# EAGLE design Relay_Board_1st_Iteration (EAGLE 9.6.2)
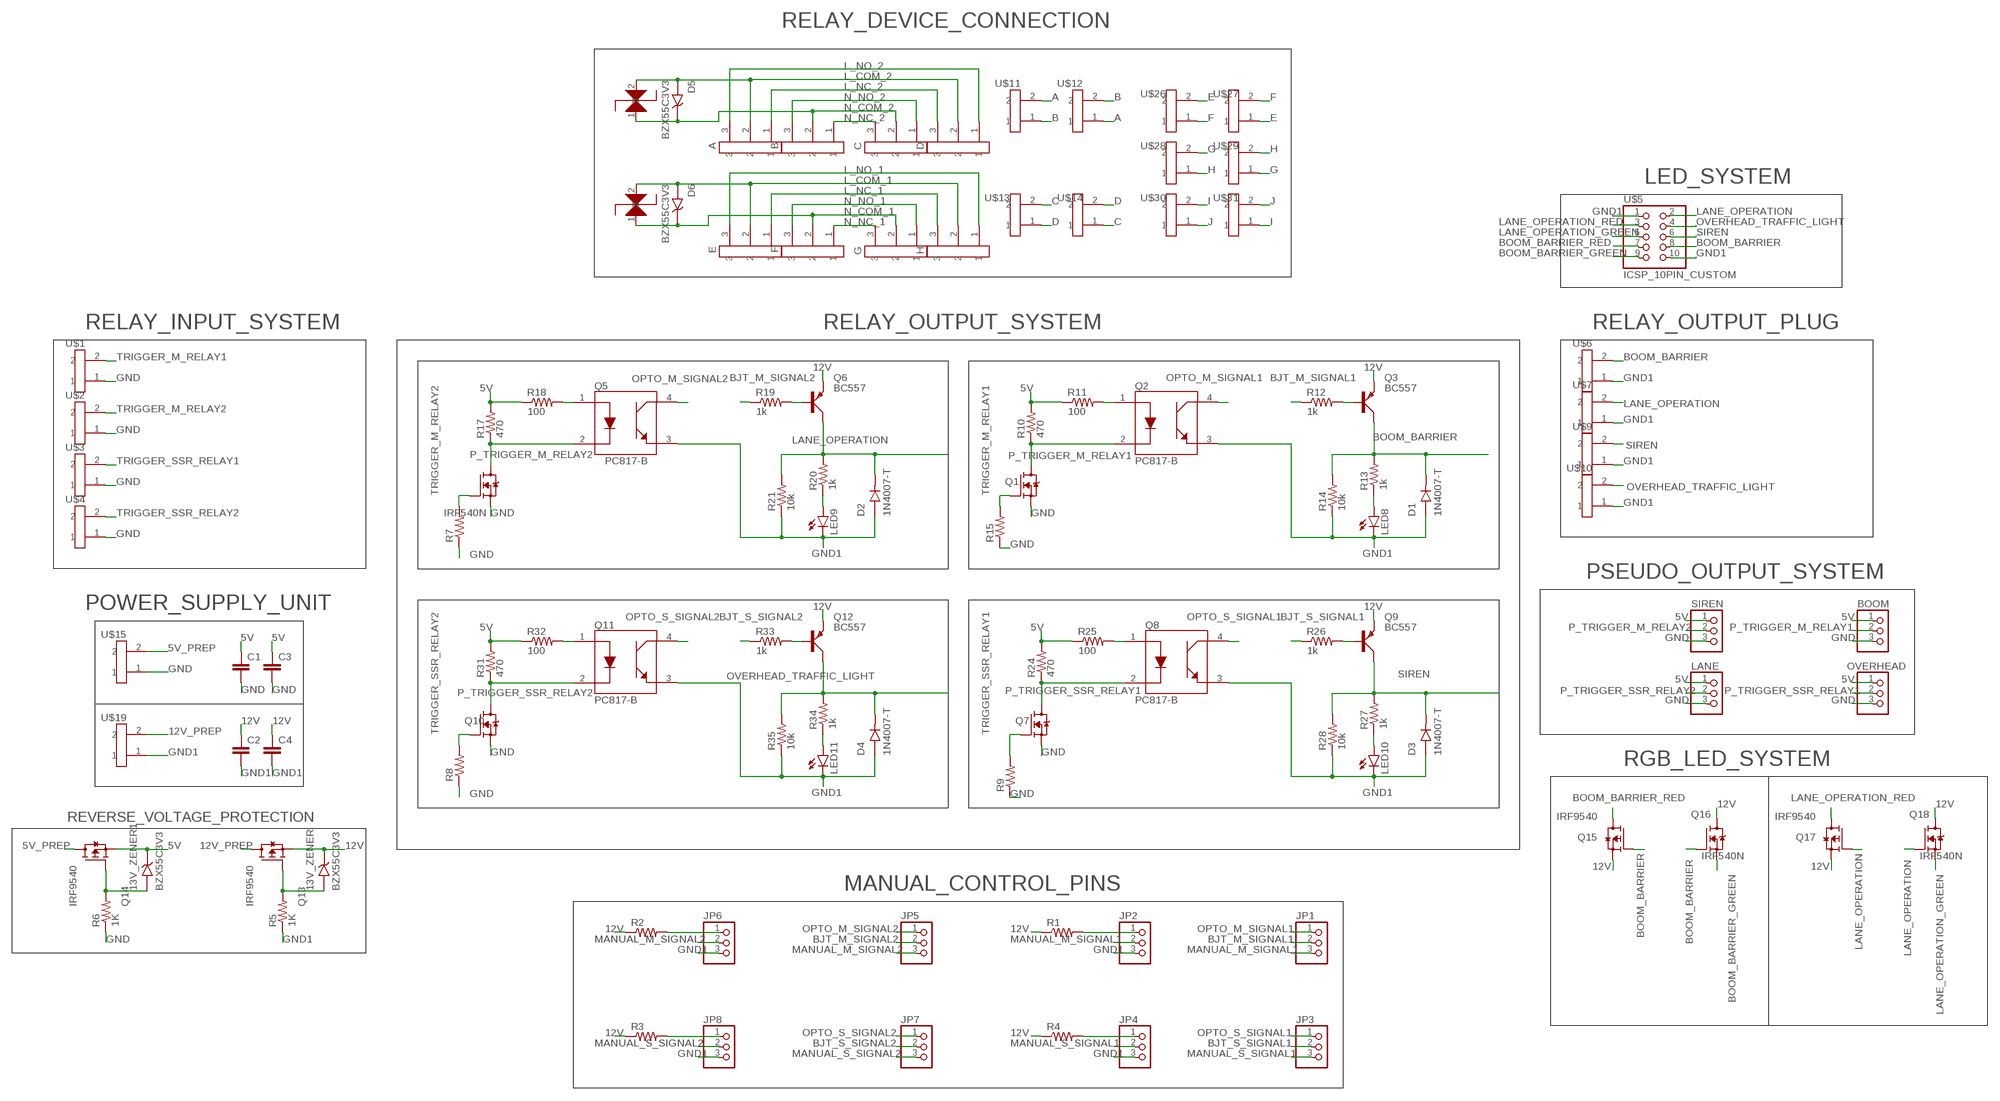
[diagram p0: schematic, sheet 1]

## Parts
13V_ZENER  BZX55C3V3  [DIOAD928W47L399D179]
13V_ZENER1  BZX55C3V3  [DIOAD928W47L399D179]
A  GREEN_PLUG_90_3  [GREEN_PLUG_90_3]
B  GREEN_PLUG_90_3  [GREEN_PLUG_90_3]
BOOM  PINHD-1X3  [1X03]
C  GREEN_PLUG_90_3  [GREEN_PLUG_90_3]
C1  CAPACITOR  [CAPACITOR]
C2  CAPACITOR  [CAPACITOR]
C3  CAPACITOR  [CAPACITOR]
C4  CAPACITOR  [CAPACITOR]
D  GREEN_PLUG_90_3  [GREEN_PLUG_90_3]
D1  1N4007-T  [DIOAD780W78L463D236]
D2  1N4007-T  [DIOAD780W78L463D236]
D3  1N4007-T  [DIOAD780W78L463D236]
D4  1N4007-T  [DIOAD780W78L463D236]
D5  BZX55C3V3  [DIOAD928W47L399D179]
D6  BZX55C3V3  [DIOAD928W47L399D179]
E  GREEN_PLUG_90_3  [GREEN_PLUG_90_3]
F  GREEN_PLUG_90_3  [GREEN_PLUG_90_3]
G  GREEN_PLUG_90_3  [GREEN_PLUG_90_3]
H  GREEN_PLUG_90_3  [GREEN_PLUG_90_3]
JP1  PINHD-1X3  [1X03]
JP2  PINHD-1X3  [1X03]
JP3  PINHD-1X3  [1X03]
JP4  PINHD-1X3  [1X03]
JP5  PINHD-1X3  [1X03]
JP6  PINHD-1X3  [1X03]
JP7  PINHD-1X3  [1X03]
JP8  PINHD-1X3  [1X03]
LANE  PINHD-1X3  [1X03]
LED8  LED  [LED]
LED9  LED  [LED]
LED10  LED  [LED]
LED11  LED  [LED]
OVERHEAD  PINHD-1X3  [1X03]
Q1  IRF540N  [TO254P1054X469X1930-3]
Q2  PC817-B  [DIP762W50P254L650H455Q4B]
Q3  BC557  [SOT54A]
Q4  IRF540N  [TO254P1054X469X1930-3]
Q5  PC817-B  [DIP762W50P254L650H455Q4B]
Q6  BC557  [SOT54A]
Q7  IRF540N  [TO254P1054X469X1930-3]
Q8  PC817-B  [DIP762W50P254L650H455Q4B]
Q9  BC557  [SOT54A]
Q10  IRF540N  [TO254P1054X469X1930-3]
Q11  PC817-B  [DIP762W50P254L650H455Q4B]
Q12  BC557  [SOT54A]
Q13  IRF9540  [TO254P1052X465X1989-3]
Q14  IRF9540  [TO254P1052X465X1989-3]
Q15  IRF9540  [TO254P1052X465X1989-3]
Q16  IRF540N  [TO254P1054X469X1930-3]
Q17  IRF9540  [TO254P1052X465X1989-3]
Q18  IRF540N  [TO254P1054X469X1930-3]
R1  RESISTOR  [RESISTOR]
R2  RESISTOR  [RESISTOR]
R3  RESISTOR  [RESISTOR]
R4  RESISTOR  [RESISTOR]
R5  1K  RESISTOR  [RESISTOR]
R6  1K  RESISTOR  [RESISTOR]
R7  RESISTOR  [RESISTOR]
R8  RESISTOR  [RESISTOR]
R9  RESISTOR  [RESISTOR]
R10  470  RESISTOR  [RESISTOR]
R11  100  RESISTOR  [RESISTOR]
R12  1k  RESISTOR  [RESISTOR]
R13  1k  RESISTOR  [RESISTOR]
R14  10k  RESISTOR  [RESISTOR]
R15  RESISTOR  [RESISTOR]
R17  470  RESISTOR  [RESISTOR]
R18  100  RESISTOR  [RESISTOR]
R19  1k  RESISTOR  [RESISTOR]
R20  1k  RESISTOR  [RESISTOR]
R21  10k  RESISTOR  [RESISTOR]
R24  470  RESISTOR  [RESISTOR]
R25  100  RESISTOR  [RESISTOR]
R26  1k  RESISTOR  [RESISTOR]
R27  1k  RESISTOR  [RESISTOR]
R28  10k  RESISTOR  [RESISTOR]
R31  470  RESISTOR  [RESISTOR]
R32  100  RESISTOR  [RESISTOR]
R33  1k  RESISTOR  [RESISTOR]
R34  1k  RESISTOR  [RESISTOR]
R35  10k  RESISTOR  [RESISTOR]
SIREN  PINHD-1X3  [1X03]
U$1  GREEN_PLUG_90_2  [GREEN_PLUG_90_2]
U$2  GREEN_PLUG_90_2  [GREEN_PLUG_90_2]
U$3  GREEN_PLUG_90_2  [GREEN_PLUG_90_2]
U$4  GREEN_PLUG_90_2  [GREEN_PLUG_90_2]
U$5  ICSP_10PIN_CUSTOM  [ICSP_10PIN_CUSTOM]
U$6  GREEN_PLUG_90_2  [GREEN_PLUG_90_2]
U$7  GREEN_PLUG_90_2  [GREEN_PLUG_90_2]
U$9  GREEN_PLUG_90_2  [GREEN_PLUG_90_2]
U$10  GREEN_PLUG_90_2  [GREEN_PLUG_90_2]
U$11  GREEN_PLUG_90_2  [GREEN_PLUG_90_2]
U$12  GREEN_PLUG_90_2  [GREEN_PLUG_90_2]
U$13  GREEN_PLUG_90_2  [GREEN_PLUG_90_2]
U$14  GREEN_PLUG_90_2  [GREEN_PLUG_90_2]
U$15  GREEN_PLUG_90_2  [GREEN_PLUG_90_2]
U$19  GREEN_PLUG_90_2  [GREEN_PLUG_90_2]
U$24  1KE100A_CUSTOM  [1KE100A_CUSTOM]
U$25  1KE100A_CUSTOM  [1KE100A_CUSTOM]
U$26  GREEN_PLUG_90_2  [GREEN_PLUG_90_2]
U$27  GREEN_PLUG_90_2  [GREEN_PLUG_90_2]
U$28  GREEN_PLUG_90_2  [GREEN_PLUG_90_2]
U$29  GREEN_PLUG_90_2  [GREEN_PLUG_90_2]
U$30  GREEN_PLUG_90_2  [GREEN_PLUG_90_2]
U$31  GREEN_PLUG_90_2  [GREEN_PLUG_90_2]

## Nets
5V: 13V_ZENER1.C(K) BOOM.1 C1.1 C3.1 LANE.1 OVERHEAD.1 Q14.3(S) R10.2 R11.1 R17.2 R18.1 R24.2 R25.1 R31.2 R32.1 SIREN.1
5V_PREP: Q14.2(D) U$15.2
12V: 13V_ZENER.C(K) C2.1 C4.1 Q3.E Q6.E Q9.E Q12.E Q13.3(S) Q15.3(S) Q16.2(D) Q17.3(S) Q18.2(D) R1.1 R2.1 R3.1 R4.1
12V_PREP: Q13.2(D) U$19.2
A: U$11.2 U$12.1
B: U$11.1 U$12.2
BJT_M_SIGNAL1: JP1.2 R12.1
BJT_M_SIGNAL2: JP5.2 R19.1
BJT_S_SIGNAL1: JP3.2 R26.1
BJT_S_SIGNAL2: JP7.2 R33.1
BOOM_BARRIER: D1.K Q3.C Q15.1(G) Q16.1(G) R13.2 R14.2 U$5.8 U$6.2
BOOM_BARRIER_GREEN: Q16.3(S) U$5.9
BOOM_BARRIER_RED: Q15.2(D) U$5.7
C: U$13.2 U$14.1
D: U$13.1 U$14.2
E: U$26.2 U$27.1
F: U$26.1 U$27.2
G: U$28.2 U$29.1
GND: BOOM.3 C1.2 C3.2 LANE.3 OVERHEAD.3 Q1.3(S) Q4.3(S) Q7.3(S) Q10.3(S) R6.1 R7.1 R8.1 R9.1 R15.1 SIREN.3 U$1.1 U$2.1 U$3.1 U$4.1 U$15.1
GND1: C2.2 C4.2 D1.A D2.A D3.A D4.A JP2.3 JP4.3 JP6.3 JP8.3 LED8.K(C) LED9.K(C) LED10.K(C) LED11.K(C) Q2.3(EMITTER) Q5.3(EMITTER) Q8.3(EMITTER) Q11.3(EMITTER) R5.1 R14.1 R21.1 R28.1 R35.1 U$5.1 U$5.10 U$6.1 U$7.1 U$9.1 U$10.1 U$19.1
H: U$28.1 U$29.2
I: U$30.2 U$31.1
J: U$30.1 U$31.2
L_COM_1: D6.A E.2 H.2 U$25.2
L_COM_2: A.2 D5.A D.2 U$24.2
L_NC_1: E.1 H.3
L_NC_2: A.1 D.3
L_NO_1: E.3 H.1
L_NO_2: A.3 D.1
LANE_OPERATION: D2.K Q6.C Q17.1(G) Q18.1(G) R20.2 R21.2 U$5.2 U$7.2
LANE_OPERATION_GREEN: Q18.3(S) U$5.5
LANE_OPERATION_RED: Q17.2(D) U$5.3
MANUAL_M_SIGNAL1: JP1.3 JP2.2
MANUAL_M_SIGNAL2: JP5.3 JP6.2
MANUAL_S_SIGNAL1: JP3.3 JP4.2
MANUAL_S_SIGNAL2: JP7.3 JP8.2
N$1: 13V_ZENER1.A Q14.1(G) R6.2
N$2: Q3.B R12.2
N$3: 13V_ZENER.A Q13.1(G) R5.2
N$8: JP2.1 R1.2
N$11: JP4.1 R4.2
N$12: LED8.A R13.1
N$14: Q2.1(ANODE) R11.2
N$16: Q6.B R19.2
N$18: LED9.A R20.1
N$19: Q5.1(ANODE) R18.2
N$23: Q9.B R26.2
N$25: LED10.A R27.1
N$26: Q8.1(ANODE) R25.2
N$28: JP6.1 R2.2
N$30: Q12.B R33.2
N$32: LED11.A R34.1
N$33: Q11.1(ANODE) R32.2
N$34: JP8.1 R3.2
N_COM_1: D6.C(K) F.2 G.2 U$25.1
N_COM_2: B.2 C.2 D5.C(K) U$24.1
N_NC_1: F.1 G.3
N_NC_2: B.1 C.3
N_NO_1: F.3 G.1
N_NO_2: B.3 C.1
OPTO_M_SIGNAL1: JP1.1 Q2.4(COLLECTOR)
OPTO_M_SIGNAL2: JP5.1 Q5.4(COLLECTOR)
OPTO_S_SIGNAL1: JP3.1 Q8.4(COLLECTOR)
OPTO_S_SIGNAL2: JP7.1 Q11.4(COLLECTOR)
OVERHEAD_TRAFFIC_LIGHT: D4.K Q12.C R34.2 R35.2 U$5.4 U$10.2
P_TRIGGER_M_RELAY1: BOOM.2 Q1.2(D) Q2.2(CATHODE) R10.1
P_TRIGGER_M_RELAY2: Q4.2(D) Q5.2(CATHODE) R17.1 SIREN.2
P_TRIGGER_SSR_RELAY1: OVERHEAD.2 Q7.2(D) Q8.2(CATHODE) R24.1
P_TRIGGER_SSR_RELAY2: LANE.2 Q10.2(D) Q11.2(CATHODE) R31.1
SIREN: D3.K Q9.C R27.2 R28.2 U$5.6 U$9.2
TRIGGER_M_RELAY1: Q1.1(G) R15.2 U$1.2
TRIGGER_M_RELAY2: Q4.1(G) R7.2 U$2.2
TRIGGER_SSR_RELAY1: Q7.1(G) R9.2 U$3.2
TRIGGER_SSR_RELAY2: Q10.1(G) R8.2 U$4.2

## Notes on the sheet
- RELAY_DEVICE_CONNECTION
- LED_SYSTEM
- RELAY_INPUT_SYSTEM | RELAY_OUTPUT_SYSTEM | RELAY_OUTPUT_PLUG
- PSEUDO_OUTPUT_SYSTEM
- POWER_SUPPLY_UNIT
- RGB_LED_SYSTEM
- REVERSE_VOLTAGE_PROTECTION
- MANUAL_CONTROL_PINS

## Library data of the parts
13V_ZENER 13V_ZENER1 D5 D6 = BZX55C3V3:BZX55C3V3: Check availability <https://pricing.snapeda.com/parts/BZX55C3V3-TR/Vishay%20Semiconductor/view-part?ref=eda>; AVAILABILITY: In Stock; CHECK_PRICES: https://www.snapeda.com/parts/BZX55C3V3-TR/Vishay/view-part/?ref=eda; DESCRIPTION: Zener Diode 3.3 V 500 mW ±6% Through Hole DO-204AH (DO-35); MF: Vishay Semiconductor; MP: BZX55C3V3-TR; PACKAGE: DO-35 NXP Semiconductors; PRICE: None; SNAPEDA_LINK: https://www.snapeda.com/parts/BZX55C3V3-TR/Vishay/view-part/?ref=snap
A B C D E F G H = Green_plug_90:GREEN_PLUG_90_3
BOOM JP1-JP8 LANE OVERHEAD SIREN = pinhead:PINHD-1X3: PIN HEADER
C1-C4 = Hand_Solder:CAPACITOR: Hand Solder Capacitor
D1-D4 = 1N4007-T:1N4007-T: Check availability <https://pricing.snapeda.com/parts/1N4007-T/Diodes%20Incorporated/view-part?ref=eda>; AVAILABILITY: In Stock; CHECK_PRICES: https://www.snapeda.com/parts/1N4007-T/Diodes+Inc./view-part/?ref=eda; DESCRIPTION: Diode Standard 1A 1000V 1Vf DO41 | Diodes Inc 1N4007-T; MF: Diodes Incorporated; MP: 1N4007-T; PACKAGE: DO-41 Diodes Inc.; PRICE: None; SNAPEDA_LINK: https://www.snapeda.com/parts/1N4007-T/Diodes+Inc./view-part/?ref=snap
LED8-LED11 = Hand_Solder:LED: LED HAND SOLDER
Q1 Q4 Q7 Q10 Q16 Q18 = IRF540N:IRF540N: Check availability <https://pricing.snapeda.com/parts/IRF540N/Infineon%20Technologies/view-part?ref=eda>; AVAILABILITY: In Stock; CHECK_PRICES: https://www.snapeda.com/parts/IRF540N/Infineon/view-part/?ref=eda; DESCRIPTION: Transistor NPN MOS IRF540/IRF540N INTERNATIONAL RECTIFIER Ampere=28 V=100 TO220; MF: Infineon Technologies; MP: IRF540N; PACKAGE: Package; PRICE: None; SNAPEDA_LINK: https://www.snapeda.com/parts/IRF540N/Infineon/view-part/?ref=snap
Q2 Q5 Q8 Q11 = PC817-B:PC817-B: Check availability <https://pricing.snapeda.com/parts/PC817-B/American%20Bright/view-part?ref=eda>; AVAILABILITY: Not in stock; CHECK_PRICES: https://www.snapeda.com/parts/PC817-B/American+Bright/view-part/?ref=eda; DESCRIPTION: Phototransistors 4-DIP (0.300, 7.62mm); MF: American Bright; MP: PC817-B; PACKAGE: DIP-4 American Bright; PRICE: None; SNAPEDA_LINK: https://www.snapeda.com/parts/PC817-B/American+Bright/view-part/?ref=snap
Q3 Q6 Q9 Q12 = BC557:BC557: Check availability <https://pricing.snapeda.com/parts/BC557/ON%20Semiconductor/view-part?ref=eda>; AVAILABILITY: Not in stock; CHECK_PRICES: https://www.snapeda.com/parts/BC557/Onsemi/view-part/?ref=eda; DESCRIPTION: Bipolar (BJT) Transistor PNP 45 V 100 mA 320MHz 625 mW Through Hole TO-92 (TO-226); MF: ON Semiconductor; MP: BC557; PACKAGE: E-PKG AXIAL-LEADED-2 ON Semiconductor; PRICE: None; SNAPEDA_LINK: https://www.snapeda.com/parts/BC557/Onsemi/view-part/?ref=snap
Q13-Q15 Q17 = IRF9540:IRF9540: Trans MOSFET P-CH 100V 6.8A 3-Pin(3+Tab) TO-220AB Check availability <https://pricing.snapeda.com/parts/IRF9540/Vishay%20Siliconix/view-part?ref=eda>; AVAILABILITY: In Stock; CHECK_PRICES: https://www.snapeda.com/parts/IRF9540/Vishay/view-part/?ref=eda; DESCRIPTION: P-Channel 100 V 19A (Tc) 3.7W (Ta), 150W (Tc) Surface Mount D²PAK (TO-263); MF: Vishay Siliconix; MP: IRF9540; PACKAGE: TO-220-3 Vishay; PRICE: None; SNAPEDA_LINK: https://www.snapeda.com/parts/IRF9540/Vishay/view-part/?ref=snap
R1-R15 R17-R21 R24-R28 R31-R35 = Hand_Solder:RESISTOR: Hand Solder Resistor
U$1-U$4 U$6 U$7 U$9-U$15 U$19 U$26-U$31 = Green_plug_90:GREEN_PLUG_90_2
U$5 = ISCP_10PIN_CUSTOM:ICSP_10PIN_CUSTOM
U$24 U$25 = 1KE100A_CUSTOM:1KE100A_CUSTOM

## Board
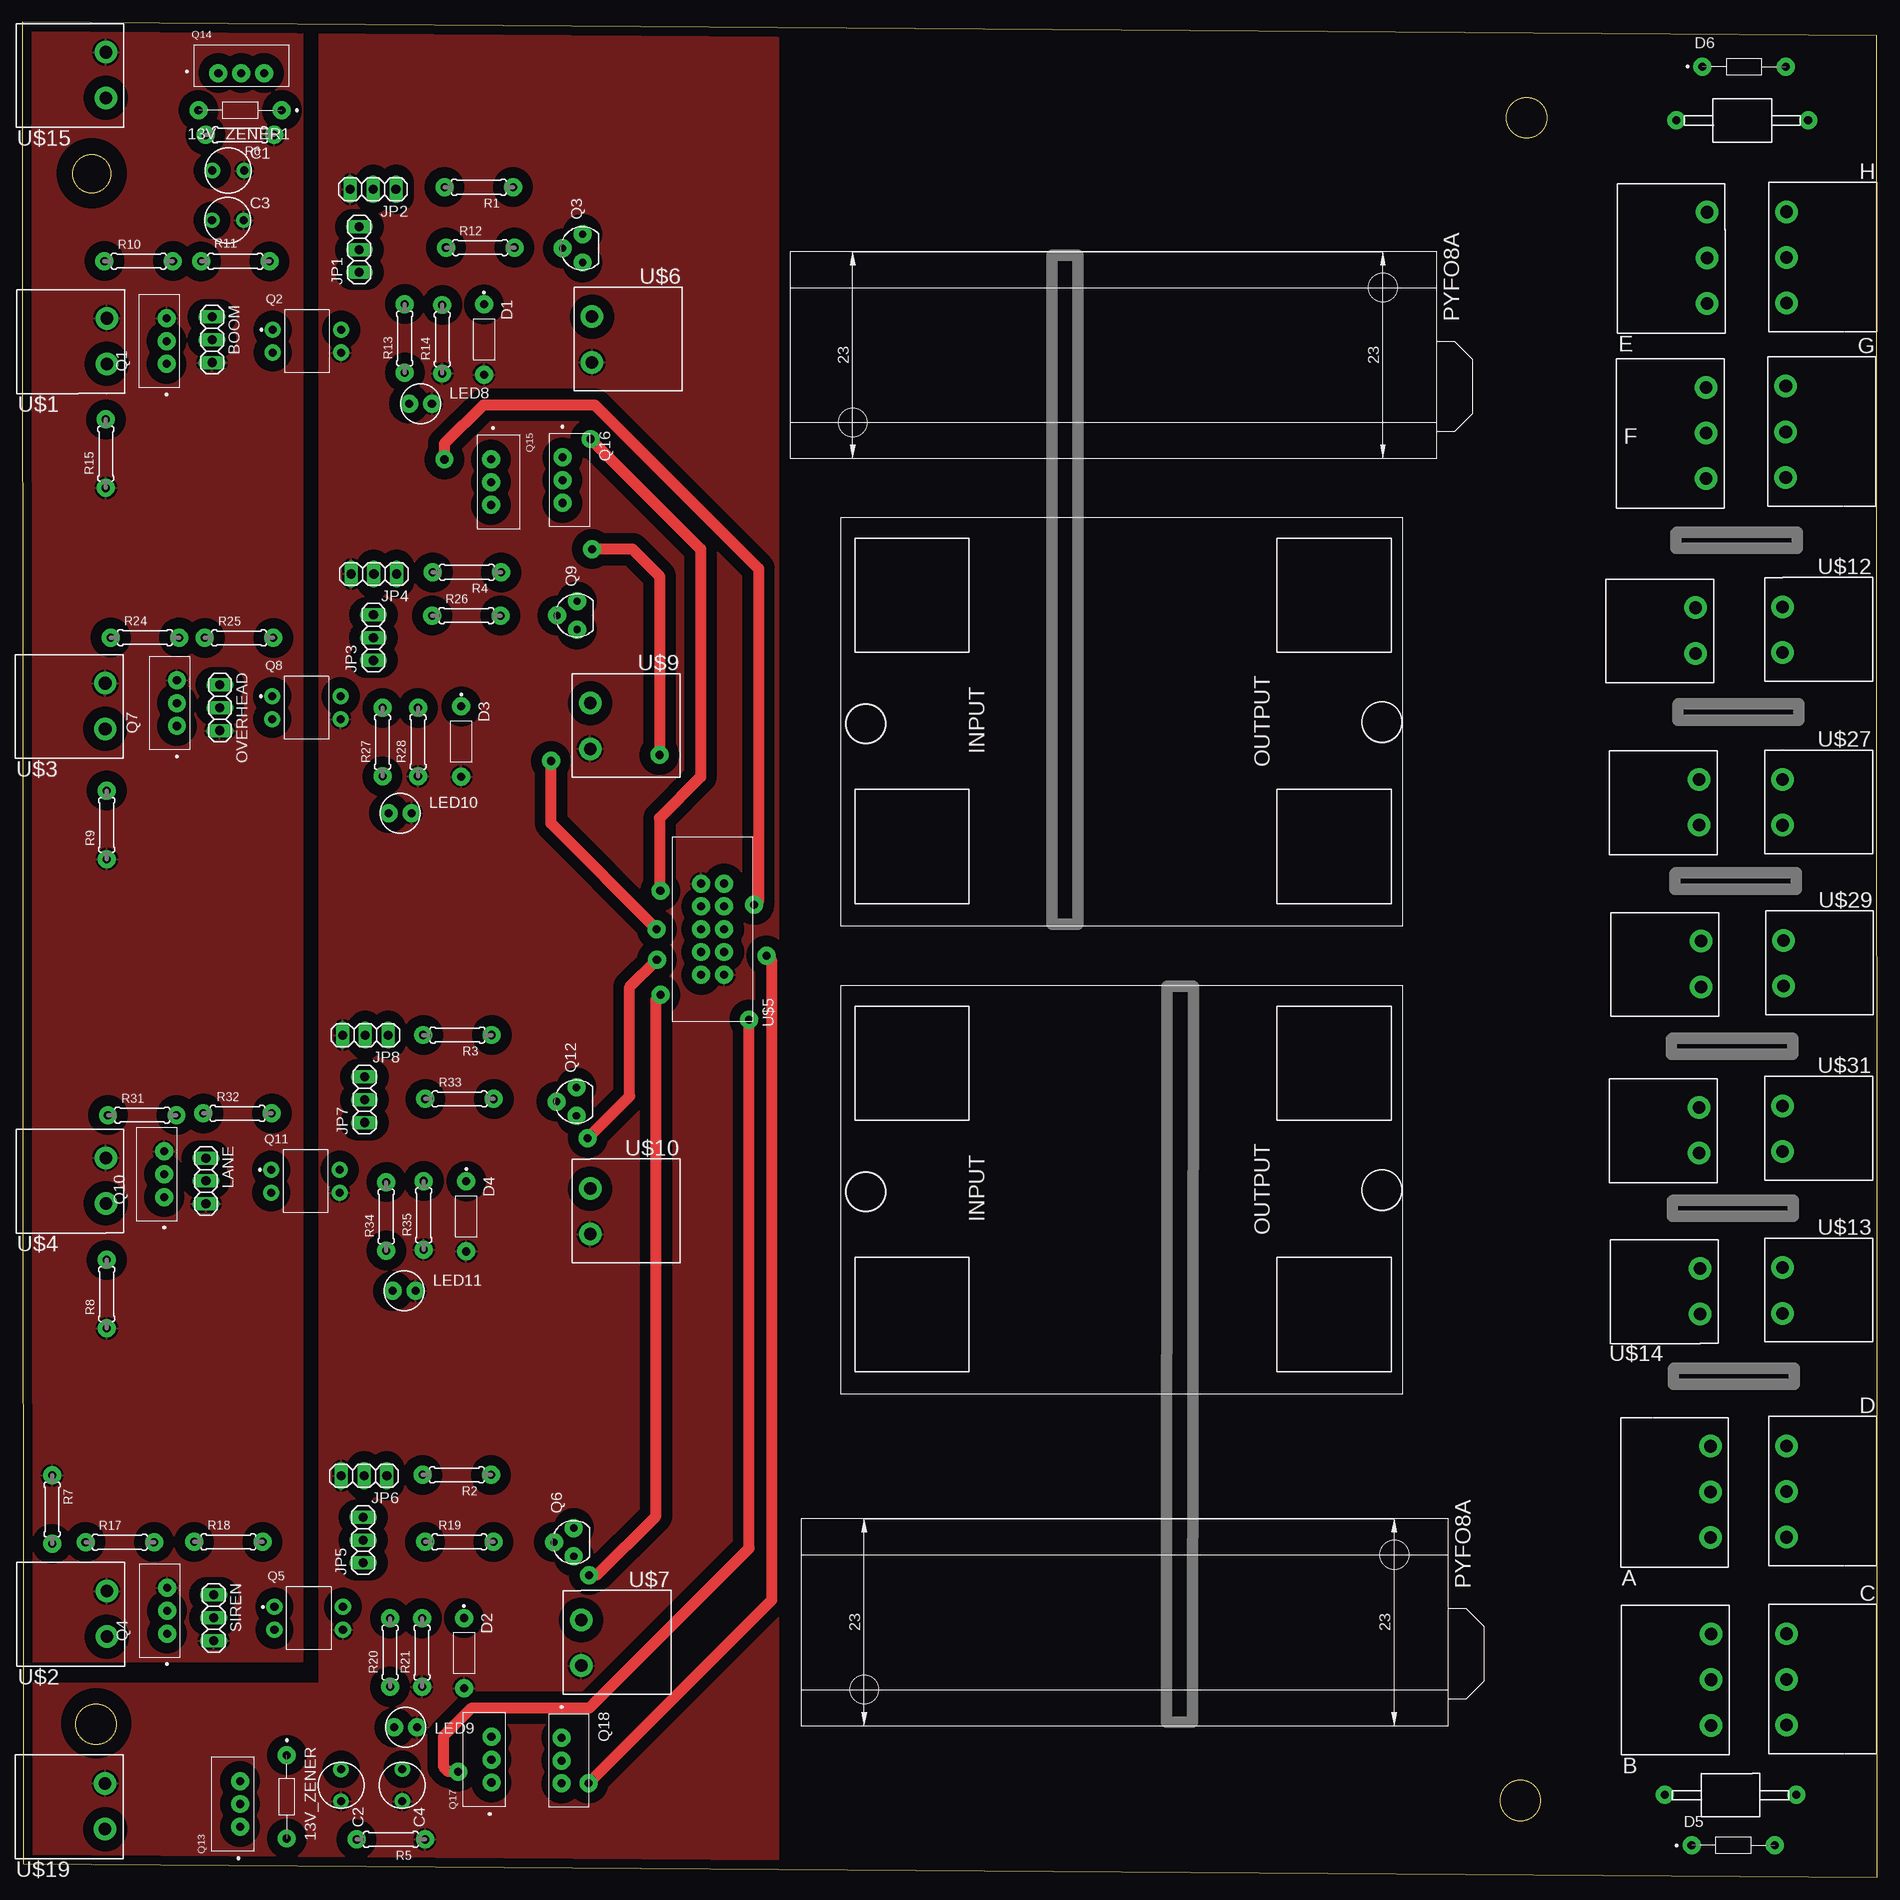
[diagram p1: board, top side]
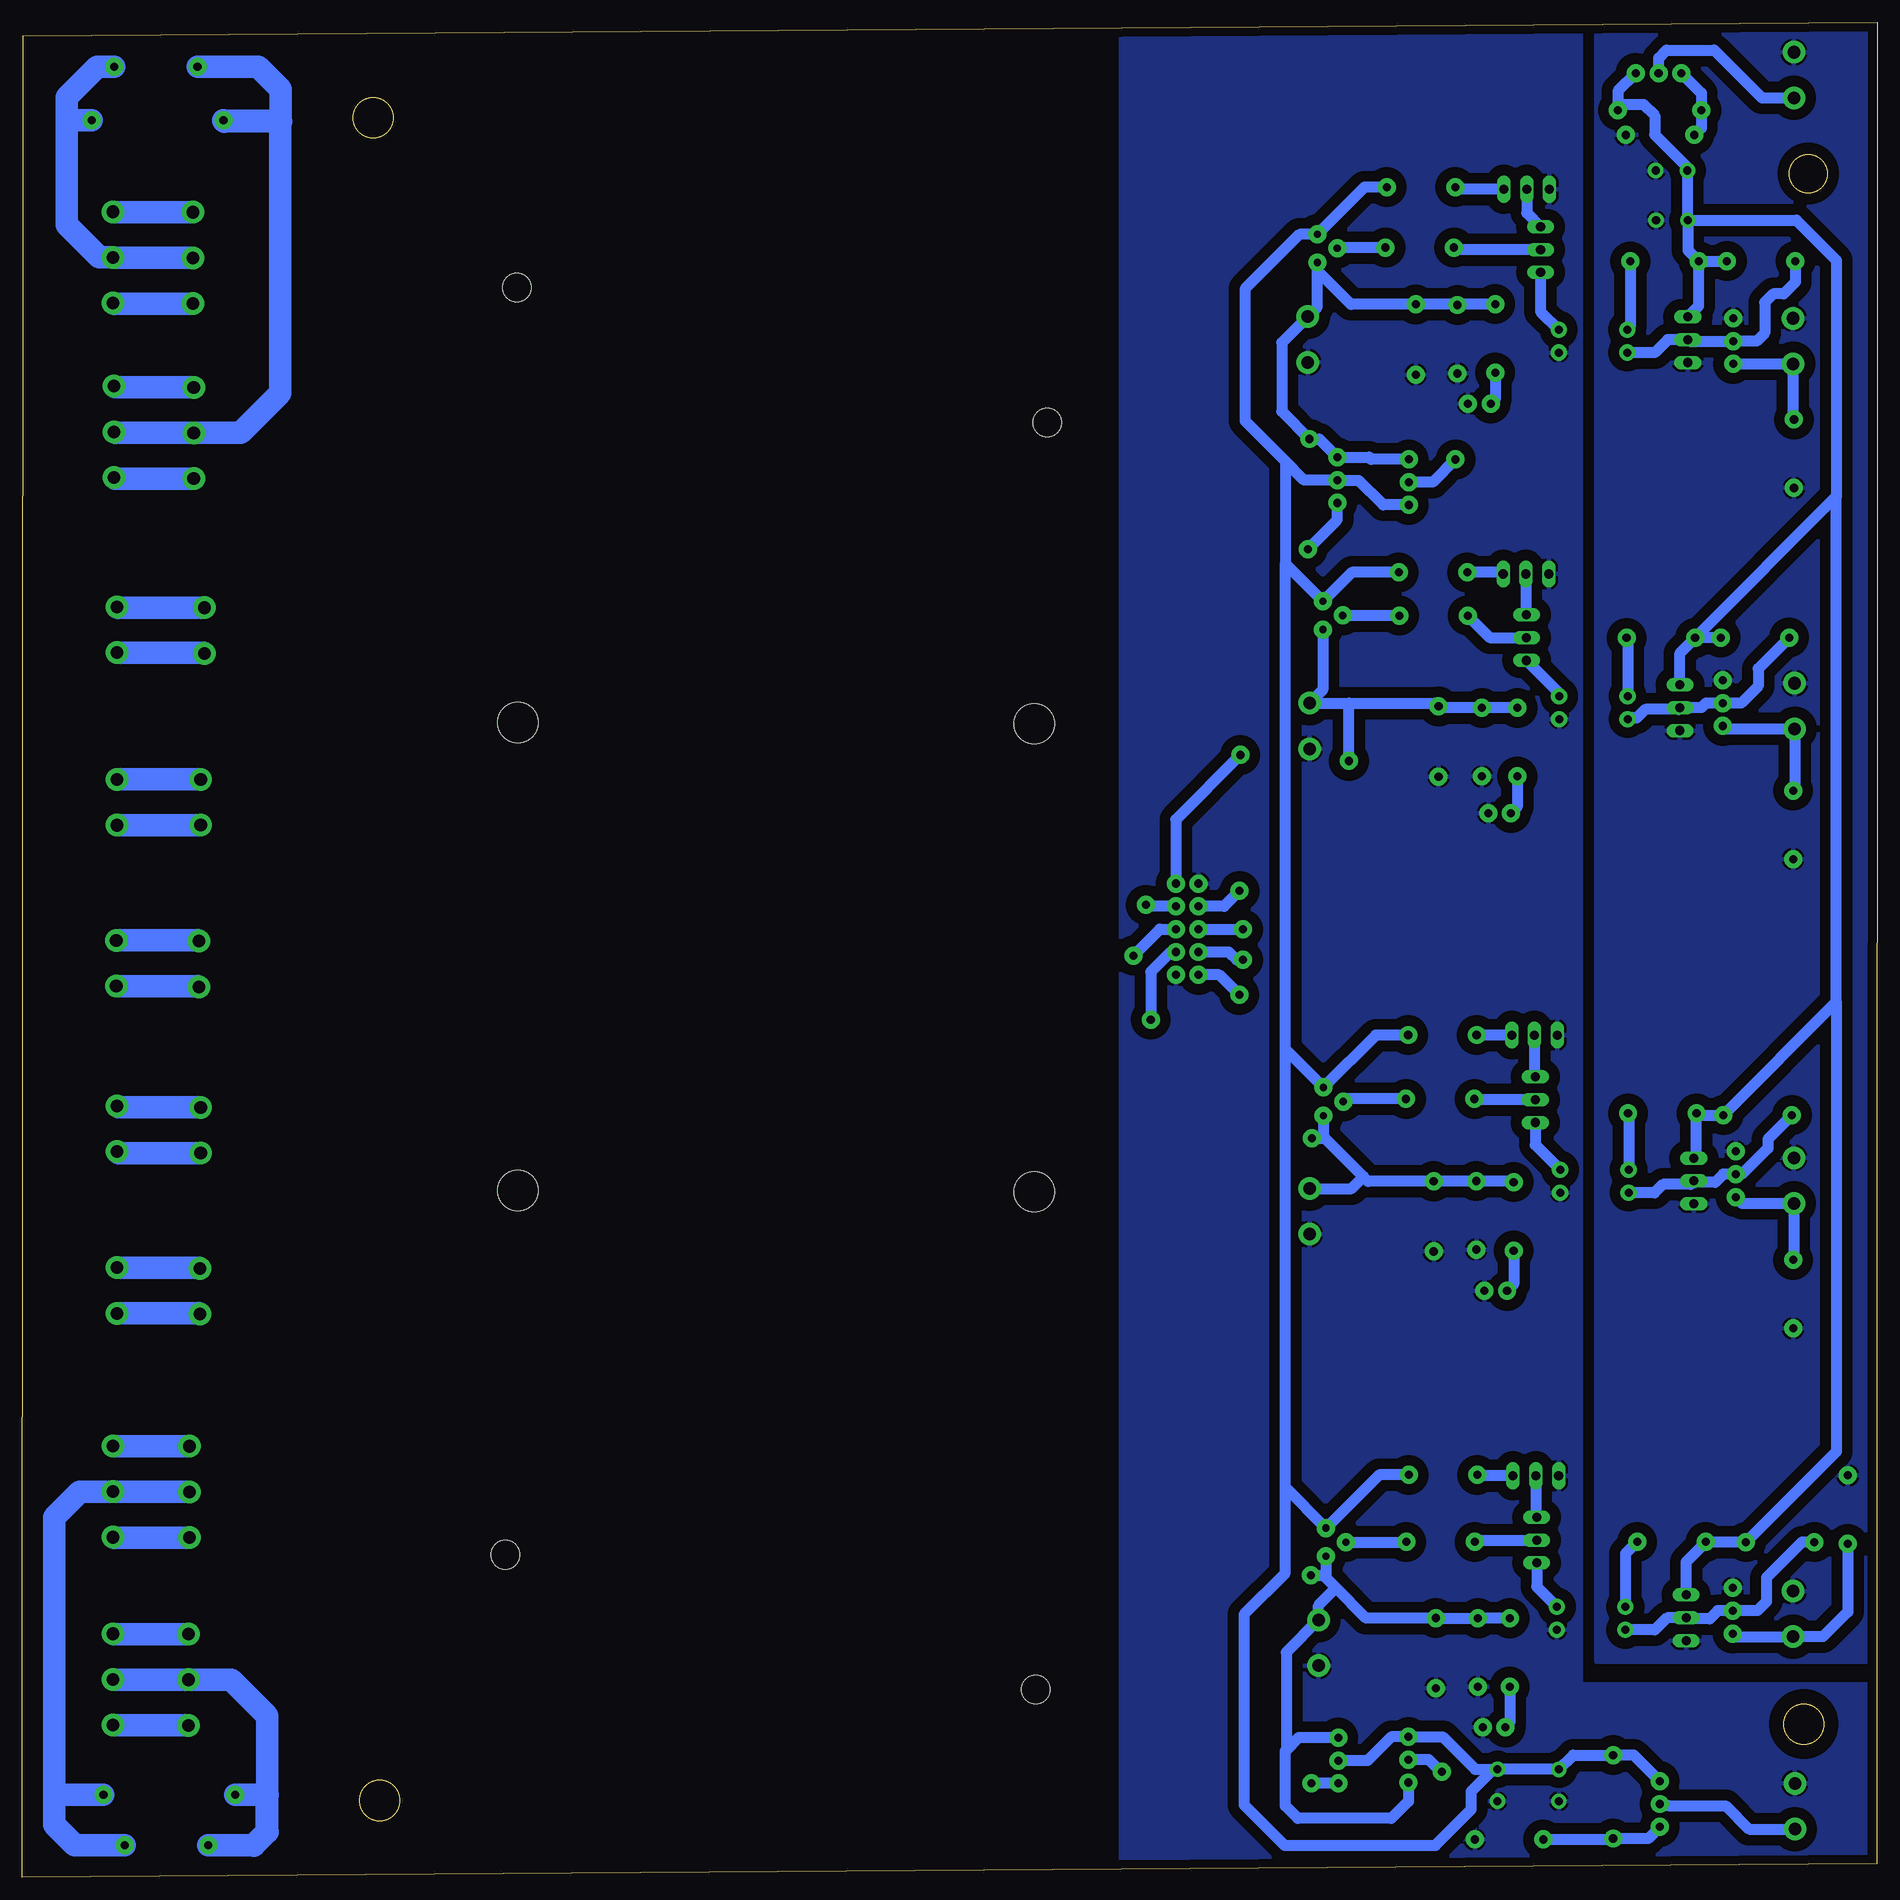
[diagram p2: board, bottom side, seen from below]

Size 206.42 x 206.35 mm. Coordinates in mm from the lower left corner, seen from the top.
Outline: 0.09,1.47 206.42,0 206.33,204.88 0,206.35 0.09,1.47
Outline: circle at 7.69,189.54 radius 2.12
Outline: circle at 8.19,17.04 radius 2.24
Outline: circle at 166.69,8.54 radius 2.24
Outline: circle at 167.39,195.74 radius 2.24
Copper layers (1*16): Top 0.035mm / dielectric 1.5mm / Bottom 0.035mm
Design rules "default *": minimum track width 1.2mm, minimum drill 0.35mm, track to track 1.2mm, track to pad 0.5mm, pad to pad 0.5mm, via to via 0.8mm, smd to smd 6mil, copper to edge 40mil, drill to drill 6mil, minimum pad ring 10mil, minimum via ring 8mil, stop-mask expansion 4mil, vias tented up to drill 0mil, thermal gap 10mil
tRestrict: area 162.9,4.7 to 170.5,12.3; area 4.4,13.3 to 12,20.9; area 3.9,185.8 to 11.5,193.4; area 163.6,191.8 to 171.2,199.5
bRestrict: area 4.4,13.2 to 12,20.8; area 4.3,186.2 to 11,192.9; area 162.9,4.7 to 170.5,12.3; area 163.6,191.9 to 171.2,199.5

### Footprints (pad centres in the part's own frame; a part is rotated, then mirrored left to right if it is on the bottom)
DIOAD928W47L399D179 = drill 0.9 pad 2: A 4.64,0; C -4.64,0
GREEN_PLUG_90_3 = drill 1.4 pad 2.5: 1 -0.041,5.012; 2 -0.041,-0.068; 3 -0.041,-5.148
1X03 = drill 1.016 long: 1 -2.54,0; 2 0,0; 3 2.54,0
CAPACITOR = drill 0.9 pad 1.7: 1 -1.77,0; 2 1.77,0
DIOAD780W78L463D236 = drill 0.9 pad 2: A 3.905,0; K -3.905,0
LED = drill 0.9 pad 2: A -1.292,-0.049; K 1.248,-0.049
TO254P1054X469X1930-3 = drill 0.9 pad 2: 1 -2.54,-0.81; 2 0,-0.81; 3 2.54,-0.81
DIP762W50P254L650H455Q4B = drill 0.9 pad 1.8: 1 -3.81,1.27; 2 -3.81,-1.27; 3 3.81,-1.27; 4 3.81,1.27
SOT54A = drill 0.8 pad 2: B 0,2.205; C -1.57,0; E 1.57,0
TO254P1052X465X1989-3 = drill 0.9 pad 2: 1 0,0; 2 2.54,0; 3 5.08,0
RESISTOR = drill 0.9 pad 2: 1 -3.777,0.007; 2 3.843,0.007
GREEN_PLUG_90_2 = drill 1.4 pad 2.5: 1 0,0; 2 0,-5.08
ICSP_10PIN_CUSTOM = drill 0.9 pad 2: 1 -5.08,-1.27; 2 -5.08,1.27; 3 -2.54,-1.27; 4 -2.54,1.27; 5 0,-1.27; 6 0,1.27; 7 2.54,-1.27; 8 2.54,1.27; 9 5.08,-1.27; 10 5.08,1.27
PYF08A-E = hole 3.2: 4,65; 19,6
SSR-40DASOLIDSTATERELAYMODULE = hole 4.5: 59.75,-22.55; 2.3,-22.7
1KE100A_CUSTOM = drill 0.9 pad 2: 1 0.027,7.334; 2 0.027,-7.321

### Placement (x,y rotation side)
13V_ZENER  29.41,8.95 270 top
13V_ZENER1  24.23,196.58 180 top
A  187.89,42.94 0 top
B  187.97,22.04 0 top
BOOM  21.1,171.05 270 top
C  196.29,21.94 180 top
C1  22.9,189.88 0 top
C2  35.45,10.22 270 top
C3  22.85,184.35 0 top
C4  42.27,10.23 270 top
D  196.29,42.84 180 top
D1  51.36,171.07 270 top
D2  49.14,24.93 270 top
D3  48.83,126.35 270 top
D4  49.38,73.52 270 top
D5  190.39,3.54 0 top
D6  191.59,201.44 0 top
E  187.51,180.22 0 top
F  187.4,160.75 0 top
G  196.19,160.74 180 top
H  196.29,180.14 180 top
JP1  37.48,181.08 90 top
JP2  39.02,187.79 180 top
JP3  39.05,137.91 90 top
JP4  39.11,144.99 180 top
JP5  37.91,37.51 90 top
JP6  38.01,44.65 180 top
JP7  38.07,86.5 90 top
JP8  38.15,93.68 180 top
LANE  20.42,77.46 270 top
LED8  44.32,163.98 0 top
LED9  42.67,16.71 0 top
LED10  42.06,118.44 0 top
LED11  42.5,65.28 0 top
OVERHEAD  21.97,130.11 270 top
Q1  15.23,170.9 90 top
Q2  31.65,170.89 0 top
Q3  62.32,181.21 90 top
Q4  15.28,29.65 90 top
Q5  31.85,28.81 0 top
Q6  61.35,37.27 90 top
Q7  16.38,130.62 90 top
Q8  31.6,130.11 0 top
Q9  61.71,140.37 90 top
Q10  14.96,78.21 90 top
Q11  31.49,77.43 0 top
Q12  61.65,86.29 90 top
Q13  24.21,5.6 90 top
Q14  21.81,200.71 0 top
Q15  52.15,157.74 270 top
Q16  60.91,155.43 270 top
Q17  52.19,10.54 90 top
Q18  60.8,12.98 270 top
R1  50.81,188.03 180 top
R2  48.37,44.77 180 top
R3  48.44,93.7 180 top
R4  49.49,145.18 180 top
R5  41.02,4.21 180 top
R6  24.23,193.84 180 top
R7  3.29,40.94 270 top
R8  9.39,64.84 90 top
R9  9.39,117.04 90 top
R10  12.9,179.79 0 top
R11  23.65,179.77 0 top
R12  50.9,181.3 0 top
R13  42.54,171.16 90 top
R14  46.73,171.07 90 top
R15  9.29,158.34 90 top
R17  10.79,37.27 0 top
R18  22.88,37.3 0 top
R19  48.58,37.29 0 top
R20  40.91,24.97 90 top
R21  44.46,24.97 90 top
R24  13.6,137.91 0 top
R25  24.06,137.87 0 top
R26  49.36,140.36 0 top
R27  40.07,126.26 90 top
R28  44.01,126.26 90 top
R31  13.29,84.78 0 top
R32  23.9,84.97 0 top
R33  48.61,86.57 0 top
R34  40.49,73.48 90 top
R35  44.65,73.61 90 top
SIREN  21.28,28.86 270 top
U$1  9.39,173.44 0 top
U$2  9.39,31.84 0 top
U$3  9.21,132.84 0 top
U$4  9.29,80.04 0 top
U$5  76.81,105.47 90 top
U$6  63.39,168.54 180 top
U$7  62.19,23.54 180 top
U$8  [PYF08A-E]  157.4,157.85 90 top
U$9  63.19,125.54 180 top
U$10  63.19,71.54 180 top
U$11  186.19,141.24 0 top
U$12  195.89,136.24 180 top
U$13  195.89,62.74 180 top
U$14  186.69,67.74 0 top
U$15  9.29,203.04 0 top
U$16  [PYF08A-E]  158.67,16.88 90 top
U$17  [SSR-40DASOLIDSTATERELAYMODULE]  153.59,105.78 180 top
U$18  [SSR-40DASOLIDSTATERELAYMODULE]  153.59,53.71 180 top
U$19  9.19,10.44 0 top
U$24  190.09,9.14 90 top
U$25  191.39,195.44 90 top
U$26  186.59,122.14 0 top
U$27  195.89,117.04 180 top
U$28  186.79,104.14 0 top
U$29  195.99,99.14 180 top
U$30  186.59,85.64 0 top
U$31  195.89,80.74 180 top

### Tracks (layer width: path | path; a pad name or v marks a point on that pad's centre or on a via)
5V
  Bottom 1.2: 19.08,37.27 R17.2 4.55,47.36 4.55,97.37 | 19.08,37.27 R18.1 | SIREN.1 21.28,35.07 19.08,37.27 | 4.55,153.61 4.55,179.89 9.01,184.35 C3.1 | 4.55,97.37 R31.2 19.93,84.79 R32.1 20.12,80.3 LANE.1 | Q14.3 28.87,198.73 13V_ZENER1.C 28.2,197.25 26.03,197.25 24.78,196 24.78,193.87 21.13,190.22 C1.1 21.13,184.39 C3.1 | R24.2 20.25,137.91 R25.1 | OVERHEAD.1 21.97,136.19 R25.1 | 4.55,97.37 4.55,153.61 | R25.1 4.55,153.61 | BOOM.1 19.87,174.82 R11.1 | R11.1 19.85,179.8 R10.2 | C3.1 21.08,180.99 R11.1
5V_PREP
  Bottom 1.2: Q14.2 24.35,202.38 23.46,203.26 18.15,203.26 12.84,197.96 U$15.2
12V
  Bottom 1.2: R1.1 57.08,188.02 Q3.E 64.3,182.78 70.38,176.7 70.38,162.02 65.88,157.52 | 65.88,157.52 65.88,146.11 | 65.88,146.11 Q9.E 58.48,145.17 R4.1 | R3.1 55.81,93.7 Q12.E 65.88,92.09 | R2.1 55.43,44.76 Q6.E 65.88,43.37 | 65.88,92.09 65.88,146.11 | 65.88,43.37 65.88,92.09 | Q13.3 27.11,13.59 13V_ZENER.C 33.86,13.59 C2.1 42.26,11.99 | Q15.3 54.99,152.66 57.73,155.4 60.07,155.4 Q16.2 63.79,155.43 65.88,157.52 | 42.26,11.99 C4.1 | 65.88,43.37 65.88,33.84 70.49,29.23 70.49,8.04 65.99,3.54 49.19,3.54 45.19,7.54 45.19,9.54 42.73,11.99 | 42.73,11.99 42.26,11.99 | Q18.2 56.74,12.98 54.11,15.62 Q17.3 48.37,15.62 44.74,11.99 42.73,11.99
12V_PREP
  Bottom 1.2: Q13.2 24.07,8 23.22,8 23.15,7.94 16.89,7.94 14.31,5.36 U$19.2
A
  Bottom 2.5: U$12.1 186.27,136.24 U$11.2
B
  Bottom 2.5: U$11.1 195.81,141.24 U$12.2
BJT_M_SIGNAL1
  Bottom 1.2: JP1.2 46.9,181.08 R12.1
BJT_M_SIGNAL2
  Bottom 1.2: R19.1 44.6,37.51 JP5.2
BJT_S_SIGNAL1
  Bottom 1.2: R26.1 43.13,137.91 JP3.2
BJT_S_SIGNAL2
  Bottom 1.2: JP7.2 44.75,86.5 R33.1
BOOM_BARRIER  (via drill 0.9 pad 2)
  Top 1.2: v63.2,160 75.46,147.74 75.46,122.42 70.89,117.84 70.89,109.84 v70.99,109.74
  Bottom 1.2: R13.2 46.63,175.01 R14.2 46.78,174.98 D1.K 58.57,174.98 62.32,178.72 Q3.C 62.32,174.69 U$6.2 66.29,170.72 66.29,163.09 v63.2,160 62.1,160 60.08,157.99 | Q16.1 60.08,157.99 | 60.08,157.99 56.58,157.99 56.34,157.74 Q15.1 | v70.99,109.74 72.71,108.01 U$5.8
BOOM_BARRIER_GREEN  (via drill 0.9 pad 2)
  Top 1.2: v63.38,147.75 67.88,147.75 70.91,144.71 70.91,124.85 v70.89,124.85
  Bottom 1.2: v63.38,147.75 60.1,151.03 Q16.3 | v70.89,124.85 78.08,117.66 U$5.9
BOOM_BARRIER_RED  (via drill 0.9 pad 2)
  Top 1.2: v46.95,157.73 46.95,159.47 51.29,163.81 63.68,163.81 81.92,145.58 81.92,108.67 v81.42,108.17
  Bottom 1.2: v46.95,157.73 49.48,155.2 Q15.2 | U$5.7 81.26,108.01 v81.42,108.17
C
  Bottom 2.5: U$14.1 186.77,67.82 U$13.2
D
  Bottom 2.5: U$13.1 186.77,62.74 U$14.2
E
  Bottom 2.5: U$27.1 186.61,117.04 U$26.2
F
  Bottom 2.5: U$26.1 195.87,122.14 U$27.2
G
  Bottom 2.5: U$29.1 186.87,99.14 U$28.2
GND
  pour Bottom: -0.65,206.33 31.25,206.33 31.25,23.96 -0.65,23.96
  pour Top: 31.18,206.29 31.18,23.99 -0.68,23.99 -0.68,206.29
GND1
  pour Bottom: -0.24,21.48 33.01,21.48 33.01,206.36 84.19,206.36 84.19,0.63 -0.24,0.63
  pour Top: 33.04,206.42 84.14,206.42 84.14,0.54 -0.23,0.54 -0.23,21.58 33.04,21.58
H
  Bottom 2.5: U$29.2 186.87,104.22 U$28.1
I
  Bottom 2.5: U$30.2 195.71,80.56 U$31.1
J
  Bottom 2.5: U$31.2 195.71,85.64 U$30.1
L_COM_1
  Bottom 2.5: 201.49,195.54 201.49,198.04 198.09,201.44 D6.A | U$25.2 201.41,195.46 201.49,195.54 | 201.49,195.54 201.49,183.84 197.85,180.2 H.2 196.28,180.16 E.2
L_COM_2
  Bottom 2.5: D5.A 200.59,3.54 202.89,5.84 202.89,9.14 | U$24.2 202.86,9.16 202.89,9.14 | A.2 196.29,42.87 | 196.29,42.87 D.2 | 202.89,9.14 202.89,40.04 200.05,42.87 196.29,42.87
L_NC_1
  Bottom 2.5: E.1 196.28,185.24 H.3
L_NC_2
  Bottom 2.5: A.1 196.29,47.95 D.3
L_NO_1
  Bottom 2.5: E.3 196.28,175.08 H.1
L_NO_2
  Bottom 2.5: A.3 196.29,37.79 D.1
LANE_OPERATION  (via drill 0.9 pad 2)
  Top 1.2: v63.04,33.6 63.91,33.6 70.5,40.18 70.5,97.67 v71,98.18
  Bottom 1.2: Q17.1 52.19,8.44 54.09,6.54 64.49,6.54 65.89,7.93 65.89,14.04 65.79,14.14 | 65.79,14.14 64.4,15.52 Q18.1 | 65.79,14.14 65.79,25.02 U$7.2 62.19,30.24 60.24,32.18 | Q6.C 61.35,33.29 | 61.35,33.29 60.24,32.18 | 60.24,32.18 56.9,28.83 D2.K 44.48,28.83 R21.2 R20.2 | v63.04,33.6 61.66,33.6 61.35,33.29 | v71,98.18 73.22,100.39 U$5.2
LANE_OPERATION_GREEN  (via drill 0.9 pad 2)
  Top 1.2: v62.99,10.44 83.36,30.82 83.36,101.96 v82.79,102.54
  Bottom 1.2: v82.79,102.54 79.85,105.47 U$5.5 | Q18.3 v62.98,10.44 v62.99,10.44
LANE_OPERATION_RED  (via drill 0.9 pad 2)
  Top 1.2: v48.49,11.74 47.39,11.74 46.89,12.24 46.89,15.74 49.99,18.84 63.09,18.84 80.86,36.61 v80.86,95.41
  Bottom 1.2: v48.49,11.74 48.59,11.84 48.69,11.84 49.93,13.08 Q17.2 | U$5.3 78.64,102.93 80.86,100.71 v80.86,95.41
MANUAL_M_SIGNAL1
  Bottom 1.2: JP2.2 39.02,185.17 JP1.3
MANUAL_M_SIGNAL2
  Bottom 1.2: JP6.2 38.01,40.14 JP5.3
MANUAL_S_SIGNAL1
  Bottom 1.2: JP4.2 39.11,140.51 JP3.3
MANUAL_S_SIGNAL2
  Bottom 1.2: JP8.2 38.15,89.13 JP7.3
N$1
  Bottom 1.2: Q14.1 19.59,198.5 13V_ZENER1.A 19.59,194.63 R6.2
N$2
  Bottom 1.2: R12.2 60.02,181.31 Q3.B
N$3
  Bottom 1.2: Q13.1 25.51,4.31 13V_ZENER.A 29.52,4.2 R5.2
N$8
  Bottom 1.2: JP2.1 46.74,187.79 R1.2
N$11
  Bottom 1.2: JP4.1 41.83,145.17 R4.2
N$12
  Bottom 1.2: R13.1 42.53,164.43 LED8.A
N$14
  Bottom 1.2: R11.2 27.49,172.51 Q2.1
N$16
  Bottom 1.2: Q6.B 52.46,37.27 R19.2
N$18
  Bottom 1.2: R20.1 40.9,17.14 LED9.A
N$19
  Bottom 1.2: R18.2 28.04,35.99 Q5.1
N$23
  Bottom 1.2: R26.2 59.49,140.36 Q9.B
N$25
  Bottom 1.2: R27.1 40.06,119.09 LED10.A
N$26
  Bottom 1.2: R25.2 27.79,137.76 Q8.1
N$28
  Bottom 1.2: JP6.1 44.42,44.65 R2.2
N$30
  Bottom 1.2: R33.2 59.15,86.58 Q12.B
N$32
  Bottom 1.2: R34.1 40.48,65.95 LED11.A
N$33
  Bottom 1.2: R32.2 27.68,84.91 Q11.1
N$34
  Bottom 1.2: JP8.1 44.58,93.68 R3.2
N_COM_1
  Bottom 2.5: D6.C 180.19,201.44 177.69,198.94 177.69,195.34 177.75,195.4 177.75,165.07 182.14,160.68 F.2 196.1,160.68 G.2
  Bottom 2.56: 177.69,195.34 183.92,195.34 U$25.1
N_COM_2
  Bottom 2.5: D5.C 180.69,3.54 | U$24.1 179.17,9.16 179.17,17.94 183.2,21.97 B.2 196.29,21.97 C.2
  Bottom 2.56: 180.69,3.54 179.17,5.05 179.17,9.16
N_NC_1
  Bottom 2.5: F.1 196.1,165.76 G.3
N_NC_2
  Bottom 2.5: B.1 196.29,27.05 C.3
N_NO_1
  Bottom 2.5: F.3 196.1,155.6 G.1
N_NO_2
  Bottom 2.5: B.3 196.29,16.89 C.1
OPTO_M_SIGNAL1
  Bottom 1.2: JP1.1 37.48,174.18 Q2.4
OPTO_M_SIGNAL2
  Bottom 1.2: JP5.1 37.91,32.34 Q5.4
OPTO_S_SIGNAL1
  Bottom 1.2: JP3.1 35.41,131.73 Q8.4
OPTO_S_SIGNAL2
  Bottom 1.2: JP7.1 38.07,81.47 Q11.4
OVERHEAD_TRAFFIC_LIGHT  (via drill 0.9 pad 2)
  Top 1.2: v62.91,82.23 67.59,86.91 67.59,99.04 v70.6,102.05
  Bottom 1.2: R34.2 40.61,77.45 R35.2 49.35,77.45 D4.K 56.67,77.42 57.18,77.94 | Q12.C 61.65,82.4 61.47,82.23 | 61.47,82.23 57.18,77.94 | v62.91,82.23 61.47,82.23 | v70.6,102.05 71.3,102.05 72.18,102.93 U$5.4 | 57.18,77.94 58.51,76.62 U$10.2
P_TRIGGER_M_RELAY1
  Bottom 1.2: Q2.2 24.78,169.62 23.34,171.05 BOOM.2 20.95,170.9 Q1.2 13.42,170.9 12.53,171.79 12.53,175.21 11.59,176.15 10.43,176.15 9.12,177.46 R10.1
P_TRIGGER_M_RELAY2
  Bottom 1.2: Q5.2 28.02,27.52 24.77,27.52 23.43,28.86 SIREN.2 21.15,28.74 18.67,28.74 17.76,29.65 Q4.2 13.34,29.65 12.34,30.65 12.34,33.33 8.4,37.27 R17.1
P_TRIGGER_SSR_RELAY1
  Bottom 1.2: Q8.2 27.65,128.98 26.8,128.98 25.85,129.93 22.15,129.93 OVERHEAD.2 19.59,130.11 19.08,130.62 Q7.2 15.16,130.62 13.27,132.51 13.27,134.47 R24.1
P_TRIGGER_SSR_RELAY2
  Bottom 1.2: Q11.2 27.64,76.12 24.81,76.12 23.86,77.08 20.81,77.08 LANE.2 20.27,77.31 18.06,77.31 17.15,78.21 Q10.2 15.08,78.21 12.19,81.1 12.19,82.11 R31.1
SIREN  (via drill 0.9 pad 2)
  Top 1.2: v58.81,124.19 58.81,117.24 v70.59,105.46
  Bottom 1.2: R27.2 R28.2 48.68,130.1 D3.K 49.19,130.62 58.79,130.62 | Q9.C 61.71,132.09 U$9.2 58.79,130.62 | v58.81,124.19 58.79,124.21 58.79,130.62 | U$5.6 70.6,105.47 v70.59,105.46
TRIGGER_M_RELAY1
  Bottom 1.2: Q1.1 U$1.2 9.39,162.29 R15.2
TRIGGER_M_RELAY2
  Bottom 1.2: Q4.1 15.74,26.76 U$2.2 6.07,26.76 3.29,29.53 R7.2
TRIGGER_SSR_RELAY1
  Bottom 1.2: Q7.1 16.87,127.76 U$3.2 9.21,121.05 R9.2
TRIGGER_SSR_RELAY2
  Bottom 1.2: Q10.1 15.06,74.96 U$4.2 9.29,68.77 R8.2

### Text on the board
tDocu: C:/Users/User/Desktop/A.bmp | PRODUCT OF BANGLADESH